# EAGLE design Powermeter (EAGLE 8.5.0)
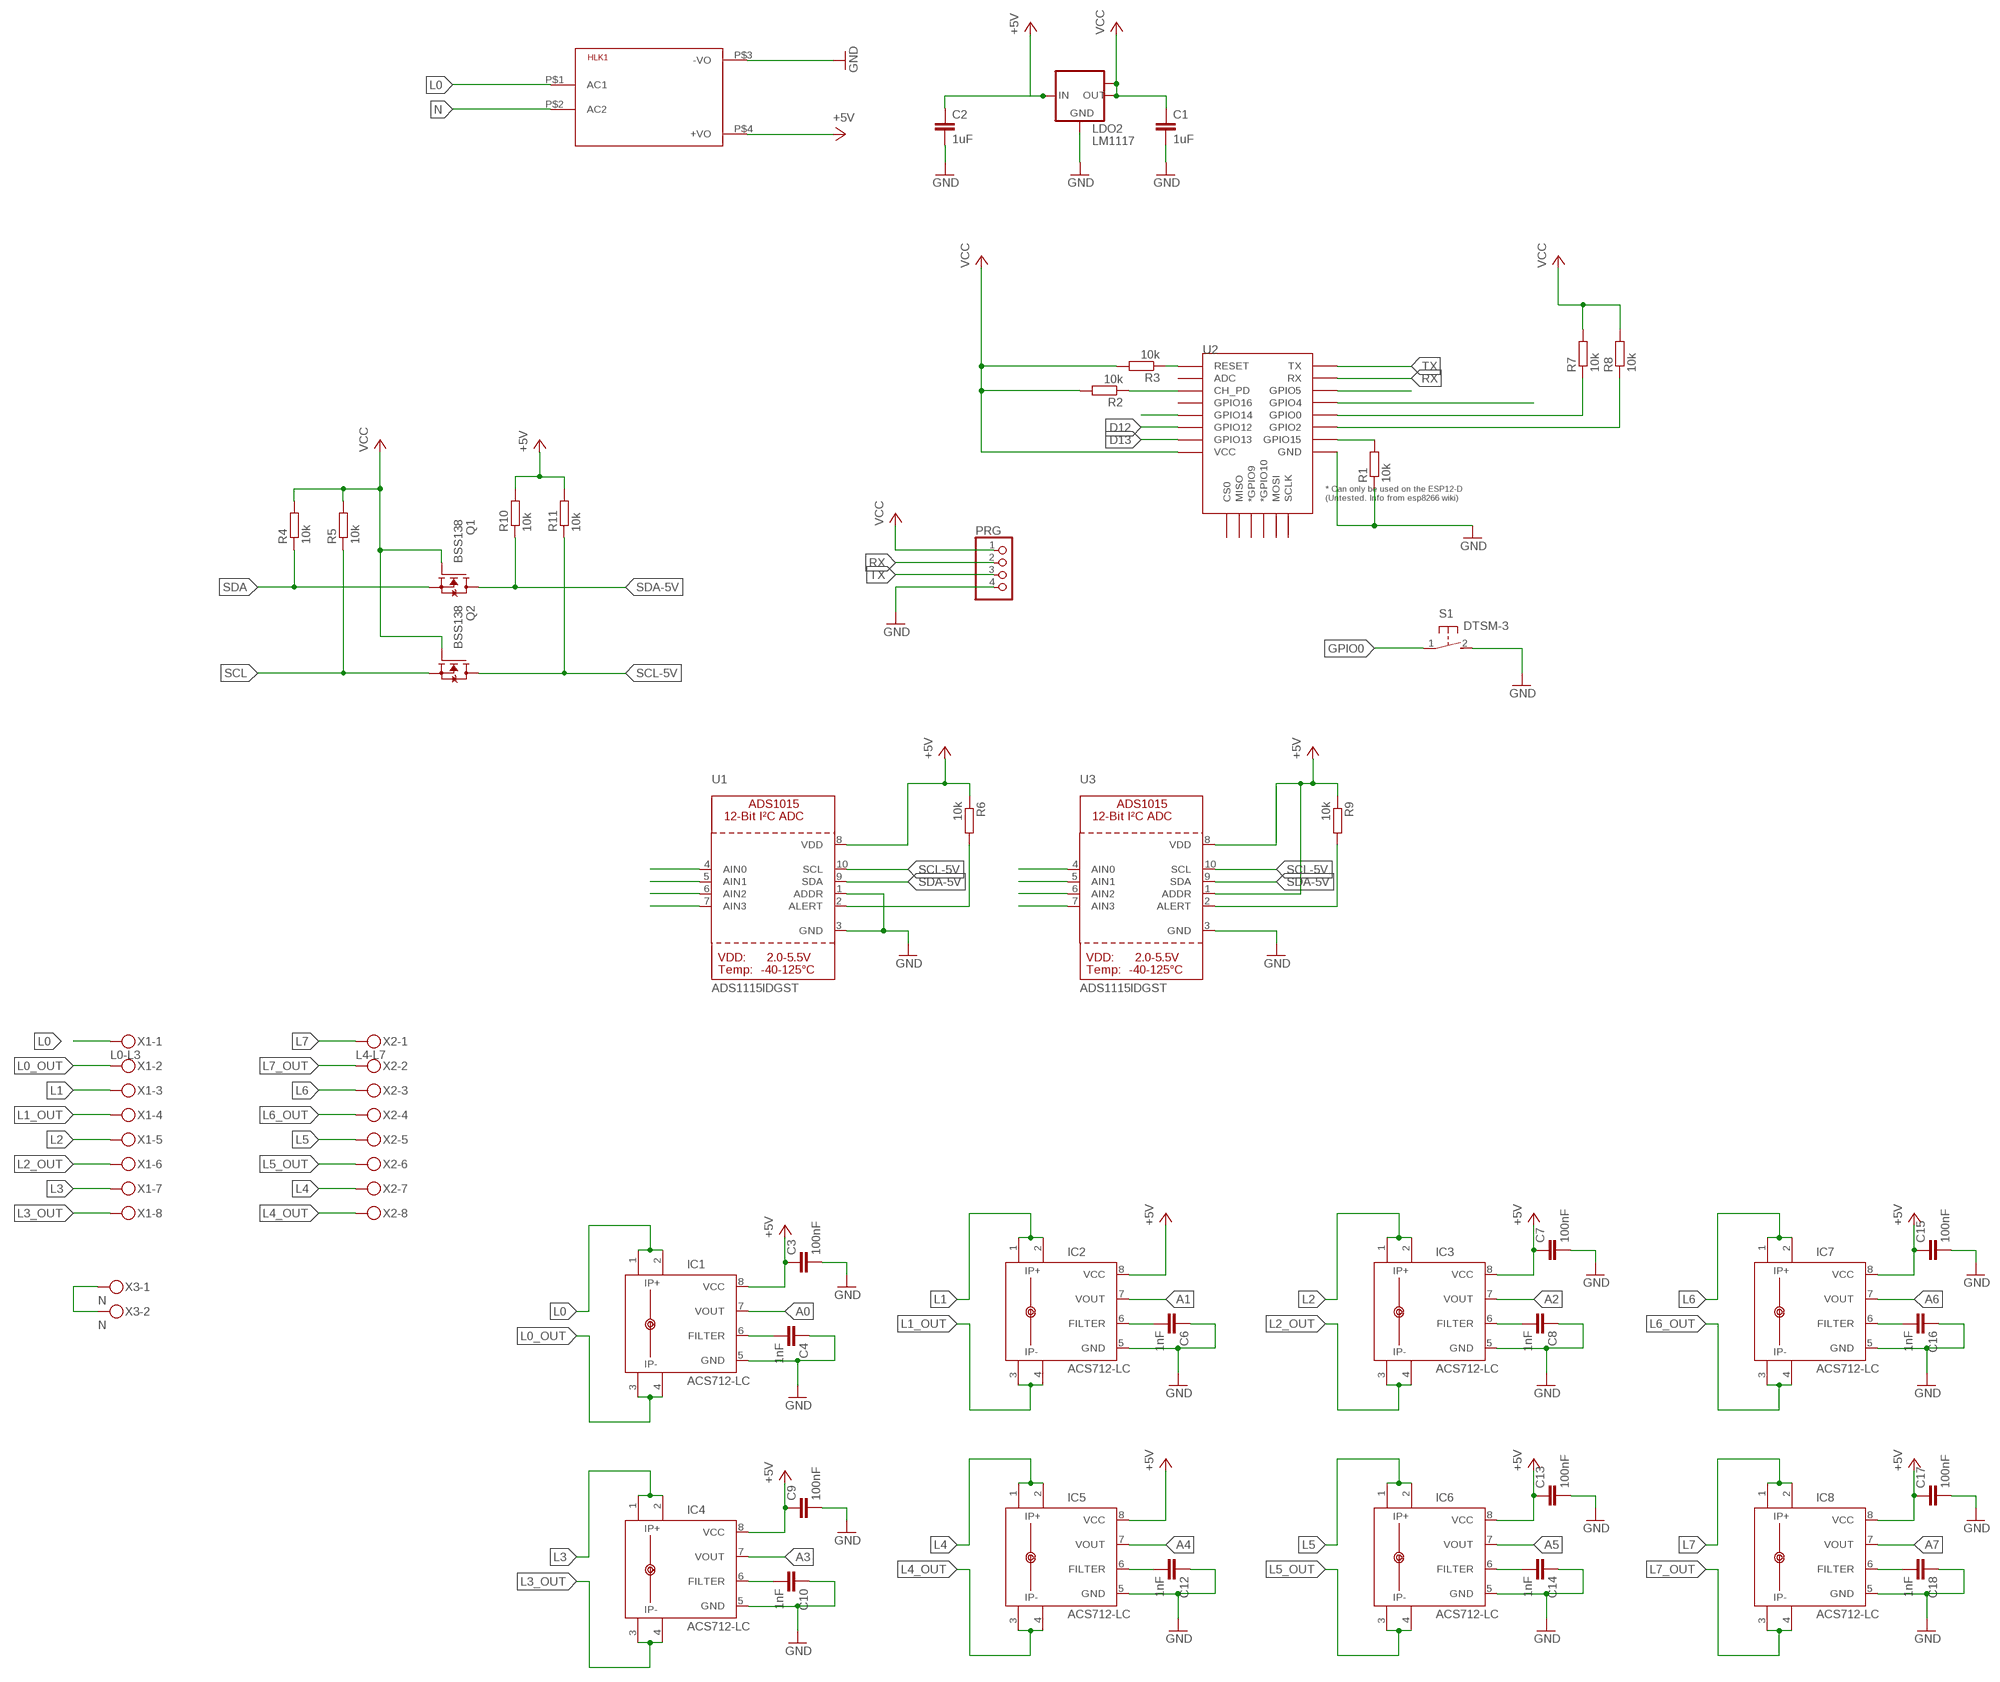
[diagram p0: schematic, sheet 1]

## Parts
C1  1uF  C-EUC0805  [C0805]
C2  1uF  C-EUC0805  [C0805]
C3  100nF  C-EUC0805  [C0805]
C4  1nF  C-EUC0805  [C0805]
C6  1nF  C-EUC0805  [C0805]
C7  100nF  C-EUC0805  [C0805]
C8  1nF  C-EUC0805  [C0805]
C9  100nF  C-EUC0805  [C0805]
C10  1nF  C-EUC0805  [C0805]
C12  1nF  C-EUC0805  [C0805]
C13  100nF  C-EUC0805  [C0805]
C14  1nF  C-EUC0805  [C0805]
C15  100nF  C-EUC0805  [C0805]
C16  1nF  C-EUC0805  [C0805]
C17  100nF  C-EUC0805  [C0805]
C18  1nF  C-EUC0805  [C0805]
HLK1  HLK-PM013W  [HLK-PM01]
IC1  ACS712-LC  [SOIC8]
IC2  ACS712-LC  [SOIC8]
IC3  ACS712-LC  [SOIC8]
IC4  ACS712-LC  [SOIC8]
IC5  ACS712-LC  [SOIC8]
IC6  ACS712-LC  [SOIC8]
IC7  ACS712-LC  [SOIC8]
IC8  ACS712-LC  [SOIC8]
LDO2  LM1117  LM1117MPX-3.3  [SOT223]
PRG  PINHD-1X04_2.54-S  [1X04-S]
Q1  BSS138  [SOT23]
Q2  BSS138  [SOT23]
R1  10k  R-EU_R0805  [R0805]
R2  10k  R-EU_R0805  [R0805]
R3  10k  R-EU_R0805  [R0805]
R4  10k  R-EU_R0805  [R0805]
R5  10k  R-EU_R0805  [R0805]
R6  10k  R-EU_R0805  [R0805]
R7  10k  R-EU_R0805  [R0805]
R8  10k  R-EU_R0805  [R0805]
R9  10k  R-EU_R0805  [R0805]
R10  10k  R-EU_R0805  [R0805]
R11  10k  R-EU_R0805  [R0805]
S1  DTSM-3  [DTSM-3]
U1  ADS1115IDGST  ADC_ADS1015  [MSOP10]
U2  ESP12ESMD  [ESP12E-SMD]
U3  ADS1115IDGST  ADC_ADS1015  [MSOP10]
X1  L0-L3  MKDSN1,5/8-5,08  [MKDSN1,5/8-5,08]
X2  L4-L7  MKDSN1,5/8-5,08  [MKDSN1,5/8-5,08]
X3  N  MKDSN1,5/2-5,08  [MKDSN1,5/2-5,08]

## Nets
+5V: C2.1 C3.1 C7.1 C9.1 C13.1 C15.1 C17.1 HLK1.P$4(+VO) IC1.8(VCC) IC2.8(VCC) IC3.8(VCC) IC4.8(VCC) IC5.8(VCC) IC6.8(VCC) IC7.8(VCC) IC8.8(VCC) LDO2.3(IN) R6.1 R9.1 R10.2 R11.2 U1.8(VDD) U3.1(ADDR) U3.8(VDD)
A0: IC1.7(VOUT) U1.4(AIN0)
A1: IC2.7(VOUT) U1.5(AIN1)
A2: IC3.7(VOUT) U1.6(AIN2)
A3: IC4.7(VOUT) U1.7(AIN3)
A4: IC5.7(VOUT) U3.4(AIN0)
A5: IC6.7(VOUT) U3.5(AIN1)
A6: IC7.7(VOUT) U3.6(AIN2)
A7: IC8.7(VOUT) U3.7(AIN3)
D2: R8.1 U2.GPIO2
D12: U2.GPIO12
D13: U2.GPIO13
D14: U2.GPIO14
GND: C1.2 C2.2 C3.2 C4.1 C6.1 C7.2 C8.1 C9.2 C10.1 C12.1 C13.2 C14.1 C15.2 C16.1 C17.2 C18.1 HLK1.P$3(-VO) IC1.5(GND) IC2.5(GND) IC3.5(GND) IC4.5(GND) IC5.5(GND) IC6.5(GND) IC7.5(GND) IC8.5(GND) LDO2.1(GND) PRG.4 R1.1 S1.2 U1.1(ADDR) U1.3(GND) U2.GND U3.3(GND)
GPIO0: R7.1 S1.1 U2.GPIO0
L0 [power]: HLK1.P$1(AC1) IC1.1(IP+) IC1.2(IP+1) X1.1
L0_OUT: IC1.3(IP-) IC1.4(IP-1) X1.2
L1: IC2.1(IP+) IC2.2(IP+1) X1.3
L1_OUT: IC2.3(IP-) IC2.4(IP-1) X1.4
L2: IC3.1(IP+) IC3.2(IP+1) X1.5
L2_OUT: IC3.3(IP-) IC3.4(IP-1) X1.6
L3: IC4.1(IP+) IC4.2(IP+1) X1.7
L3_OUT: IC4.3(IP-) IC4.4(IP-1) X1.8
L4: IC5.1(IP+) IC5.2(IP+1) X2.7
L4_OUT: IC5.3(IP-) IC5.4(IP-1) X2.8
L5: IC6.1(IP+) IC6.2(IP+1) X2.5
L5_OUT: IC6.3(IP-) IC6.4(IP-1) X2.6
L6: IC7.1(IP+) IC7.2(IP+1) X2.3
L6_OUT: IC7.3(IP-) IC7.4(IP-1) X2.4
L7: IC8.1(IP+) IC8.2(IP+1) X2.1
L7_OUT: IC8.3(IP-) IC8.4(IP-1) X2.2
N [power]: HLK1.P$2(AC2) X3.1 X3.2
N$1: R1.2 U2.GPIO15
N$2: R6.2 U1.2(ALERT)
N$3: R2.1 U2.CH_PD
N$4: R9.2 U3.2(ALERT)
N$5: C4.2 IC1.6(FILTER)
N$6: C6.2 IC2.6(FILTER)
N$7: C8.2 IC3.6(FILTER)
N$8: C10.2 IC4.6(FILTER)
N$9: C12.2 IC5.6(FILTER)
N$10: C14.2 IC6.6(FILTER)
N$11: C16.2 IC7.6(FILTER)
N$12: C18.2 IC8.6(FILTER)
RESET: R3.1 U2.RESET
RX: PRG.2 U2.RXD0(RX)
SCL: Q2.2(S) R5.1 U2.GPIO5
SCL-5V: Q2.3(D) R11.1 U1.10(SCL) U3.10(SCL)
SDA: Q1.2(S) R4.1 U2.GPIO4
SDA-5V: Q1.3(D) R10.1 U1.9(SDA) U3.9(SDA)
TX: PRG.3 U2.TXD0(TX)
VCC: C1.1 LDO2.2(OUT) LDO2.TAB(OUT1) PRG.1 Q1.1(G) Q2.1(G) R2.2 R3.2 R4.2 R5.2 R7.2 R8.2 U2.VCC
Unconnected: U2.ADC U2.CS0 U2.GPIO9(*GPIO9) U2.GPIO10(*GPIO10) U2.GPIO16 U2.MISO U2.MOSI U2.SCLK

## Library data of the parts
C1-C4 C6-C10 C12-C18 = rcl:C-EU: CAPACITOR, European symbol; SPICEPREFIX: C
HLK1 = HLK-PM01:HLK-PM01: Hi-Link Power Supply HLK-PM01 3W Author: Ahmed Said <https://github.com/AhmedSaid/EAGLELibraries>
IC1-IC8 = allegro-2:ACS712-LC
LDO2 = lm1117:LM1117MPX-*
PRG = pinhead-2:PINHD-1X04: PIN HEADER
Q1 Q2 = bss138_10:BSS138: BSS138 N-Channel Logic Level Enhancement Mode Field Effect Transistor Source: http://www.fairchildsemi.com/datasheets/BS/BSS138.pdf; MF: Fairchild; MPN: BSS138; OC_FARNELL: 9845330; OC_NEWARK: 67R2009
R1-R11 = rcl:R-EU_: RESISTOR, European symbol; SPICEPREFIX: R
S1 = switch-tact:DTSM-3
U1 U3 = microbuilder:ADC_ADS1015: ADS1015 - 12-bit 4-Channel I2C ADC with Internal PGA VDD: 2.0-5.5V Sampling Rate: 3.3ksps Gain Settings: 2/3, 1, 2, 4, 8, 16 I2C Address: ADDR low = 1001000x, ADDR high = 1001001x Internal Comparator The ADS1015 includes an internal comparator that can be set to output a high-level on ALERT when the conversion results exceeeds a pre-defined upper level, and will deassert itself when the level falls below a pre-defined lower threshold level. It can also be set to windowed mode where the ALERT pin will be asserted if the data exceeds the upper threshold or falls below the lower threshold.
U2 = esp8266modules:ESP12E: ESP12E Module
X1 X2 = con-phoenix-508:MKDSN1,5/8-5,08: MKDSN 1,5/ 8-5,08 Printklemme Nennstrom: 13,5 A Nennspannung: 250 V Rastermaß: 5,08 mm Polzahl: 8 Anschlussart: Schraubanschluss Montage: Löten Anschlussrichtung Leiter/Platine: 0 ° Artikelnummer: 1729186 Source: http://eshop.phoenixcontact.com .. 1729186.pdf
X3 = con-phoenix-508:MKDSN1,5/2-5,08: MKDSN 1,5/ 2-5,08 Printklemme Nennstrom: 13,5 A Nennspannung: 250 V Rastermaß: 5,08 mm Polzahl: 2 Anschlussart: Schraubanschluss Montage: Löten Anschlussrichtung Leiter/Platine: 0 ° Artikelnummer: 1729128 Source: http://eshop.phoenixcontact.com .. 1729128.pdf

## Net classes
0 default: width 0.152 mm
1 power: width 0.381 mm

## Board
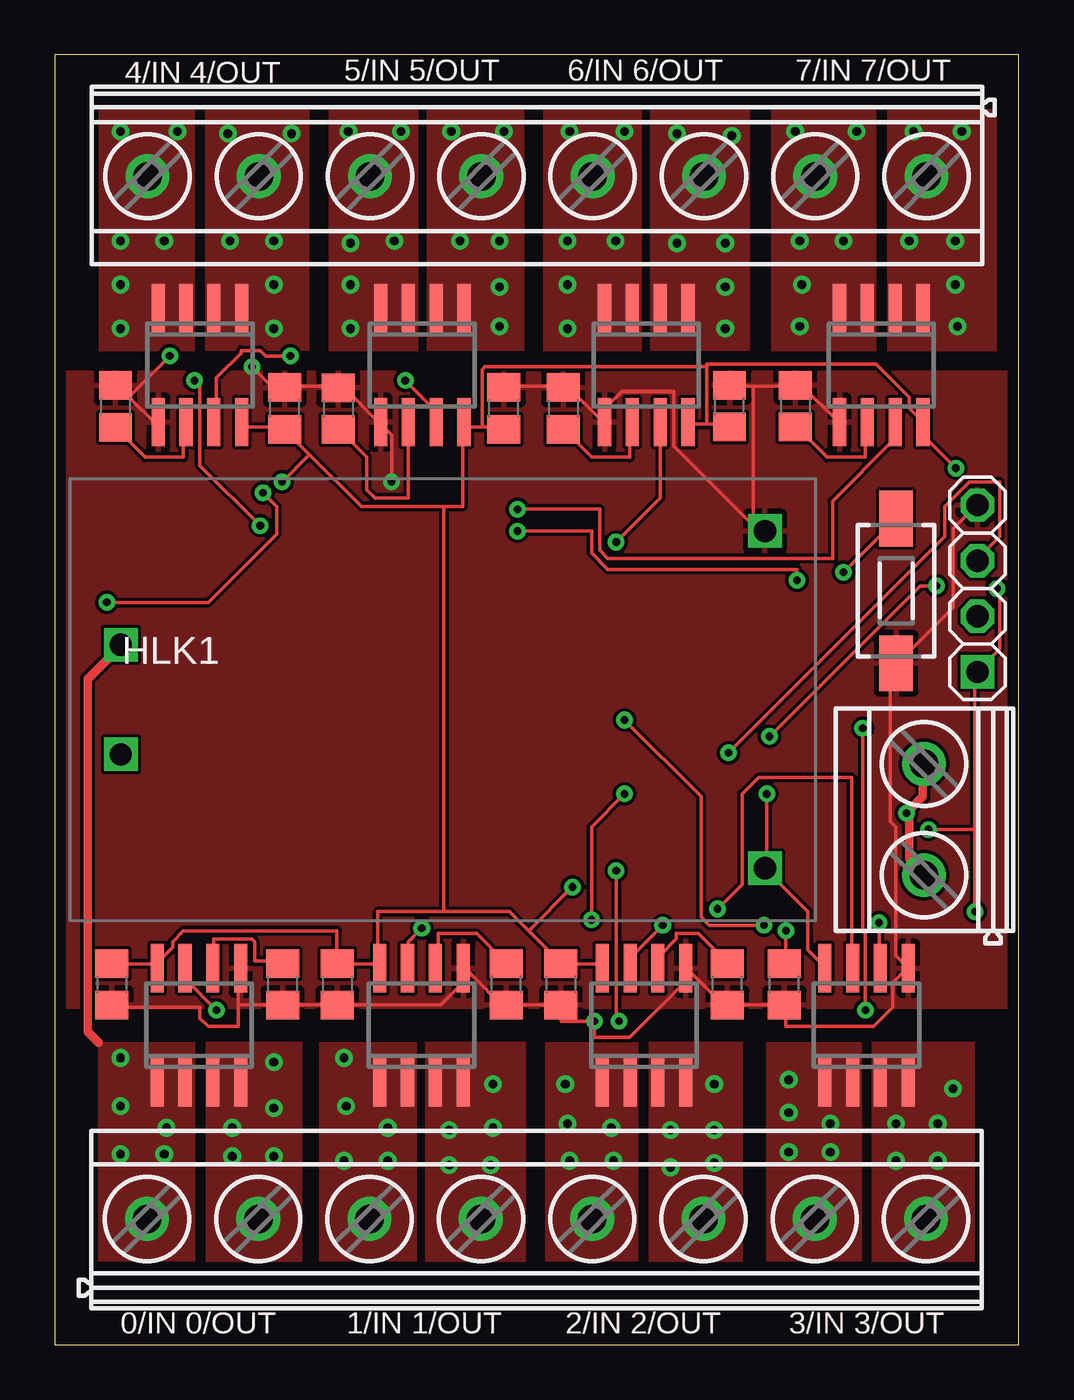
[diagram p1: board, top side]
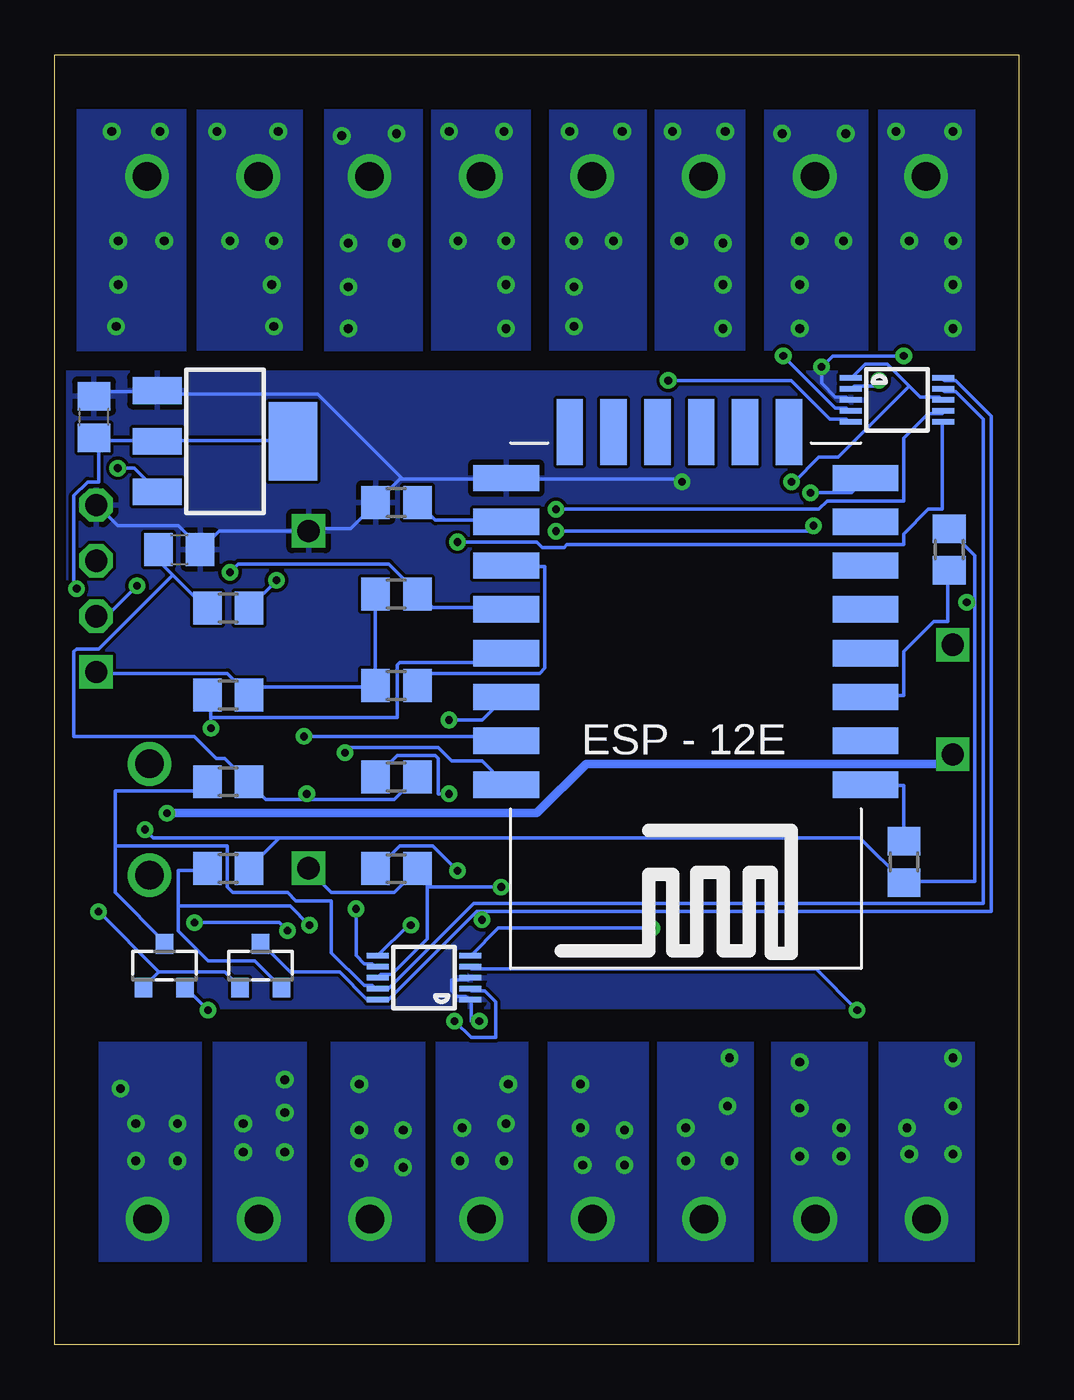
[diagram p2: board, bottom side, seen from below]

Size 44 x 58.9 mm. Coordinates in mm from the lower left corner, seen from the top.
Outline: 0,0 44,0 44,58.9 0,58.9 0,0
Copper layers (1*16): Top 0.035mm / dielectric 1.5mm / Bottom 0.035mm
Design rules "default *": minimum track width 6mil, minimum drill 0.35mm, track to track 6mil, track to pad 6mil, pad to pad 6mil, via to via 6mil, smd to smd 6mil, copper to edge 20mil, drill to drill 6mil, minimum pad ring 10mil, minimum via ring 8mil, stop-mask expansion 4mil, vias tented up to drill 100mil, thermal gap 10mil

### Footprints (pad centres in the part's own frame; a part is rotated, then mirrored left to right if it is on the bottom)
C0805 = smd 1.3 x 1.5: 1 -0.95,0; 2 0.95,0
HLK-PM01 = drill 1.016 square: P$1 -14.7,2.5; P$2 -14.7,-2.5; P$3 14.7,7.7; P$4 14.7,-7.7
SOIC8 = smd 0.6 x 2.2: 1 -1.905,-2.6; 2 -0.635,-2.6; 3 0.635,-2.6; 4 1.905,-2.6; 5 1.905,2.6; 6 0.635,2.6; 7 -0.635,2.6; 8 -1.905,2.6
SOT223 = smd 1.219 x 2.235: 1 -2.311,-3.099; 2 0,-3.099; 3 2.311,-3.099 | smd 3.6 x 2.2: TAB 0,3.099
1X04-S = drill 1.016 square: 1 -3.81,0 | drill 1.016 octagon: 2 -1.27,0; 3 1.27,0; 4 3.81,0
SOT23 = smd 0.8 x 0.9: 1 -0.95,-1; 2 0.95,-1; 3 0,1
R0805 = smd 1.3 x 1.5: 1 -0.95,0; 2 0.95,0
DTSM-3 = smd 2.54 x 1.524: 1 -3.302,0; 2 3.302,0
MSOP10 = smd 0.25 x 1: 1 -1,-2.113; 2 -0.5,-2.113; 3 0,-2.113; 4 0.5,-2.113; 5 1,-2.113; 6 1,2.113; 7 0.5,2.113; 8 0,2.113; 9 -0.5,2.113; 10 -1,2.113
ESP12E-SMD = smd 3 x 1.2: ADC -8.3,3.8; CH_PD -8.3,1.8; GND 8.1,-8.2; GPIO0 8.1,-2.2; GPIO2 8.1,-4.2; GPIO4 8.1,-0.2; GPIO5 8.1,1.8; GPIO12 -8.3,-4.2; GPIO13 -8.3,-6.2; GPIO14 -8.3,-2.2; GPIO15 8.1,-6.2; GPIO16 -8.3,-0.2; RESET -8.3,5.8; RXD0 8.1,3.8; TXD0 8.1,5.8; VCC -8.3,-8.2 | smd 1.2 x 3: CS0 -4.8,-10.3; GPIO9 -0.8,-10.3; GPIO10 1.2,-10.3; MISO -2.8,-10.3; MOSI 3.2,-10.3; SCLK 5.2,-10.3
MKDSN1,5/8-5,08 = drill 1.3 pad 2: 1 -17.801,0.025; 2 -12.721,0.025; 3 -7.641,0.025; 4 -2.561,0.025; 5 2.519,0.025; 6 7.599,0.025; 7 12.679,0.025; 8 17.759,0.025
MKDSN1,5/2-5,08 = drill 1.3 pad 2: 1 -2.561,0.025; 2 2.519,0.025

### Placement (x,y rotation side)
C1  42.21,42.36 90 bottom
C2  38.32,36.31 0 bottom
C3  2.6,16.46 270 top
C4  10.4,16.46 90 top
C6  20.6,16.46 90 top
C7  23.1,16.46 270 top
C8  30.7,16.46 90 top
C9  12.9,16.46 270 top
C10  33.3,16.46 90 top
C12  2.77,42.85 270 top
C13  30.8,42.86 90 top
C14  12.93,42.74 270 top
C15  10.5,42.76 90 top
C16  23.2,42.76 270 top
C17  20.5,42.76 90 top
C18  33.8,42.86 270 top
HLK1  17.71,29.46 0 top
IC1  6.58,14.59 0 top
IC2  16.74,14.59 0 top
IC3  26.89,14.59 0 top
IC4  37.05,14.59 0 top
IC5  6.62,44.73 180 top
IC6  16.78,44.73 180 top
IC7  27,44.73 180 top
IC8  37.72,44.73 180 top
LDO2  36.23,41.25 270 bottom
PRG  42.11,34.53 90 top
Q1  39,17.3 0 bottom
Q2  34.6,17.3 0 bottom
R1  28.41,38.46 0 bottom
R2  3.18,36.3 90 bottom
R3  5.24,22.04 270 bottom
R4  36.09,29.67 0 bottom
R5  36.09,21.75 0 bottom
R6  28.41,21.74 180 bottom
R7  28.41,34.28 180 bottom
R8  28.41,30.1 180 bottom
R9  36.09,33.63 0 bottom
R10  36.09,25.71 0 bottom
R11  28.41,25.92 0 bottom
S1  38.4,34.42 270 top
U1  27.14,16.76 90 bottom
U2  15.29,31.38 180 bottom
U3  5.56,43.14 270 bottom
X1  22.01,5.72 0 top
X2  21.99,53.38 180 top
X3  39.7,24 90 top

### Tracks (layer width: path | path; a pad name or v marks a point on that pad's centre or on a via)
+5V  (via drill 0.35)
  Top 0.152: IC4.8 35.12,17.27 34.38,18.02 34.38,19.77 32.5,21.65 HLK1.P$4 32.5,21.77 v32.5,25.15 | 4.62,17.4 2.62,17.4 C3.1 | 4.62,17.4 4.62,17.27 IC1.8 4.62,17.4 | IC3.8 24.88,17.27 24.88,17.4 23.12,17.4 C7.1 23,17.52 21.62,18.9 | 14.75,17.4 13,17.4 C9.1 12.88,17.52 12.88,18.9 5.88,18.9 5.38,18.4 5.38,18.15 4.62,17.4 | 14.75,17.4 14.75,17.27 IC2.8 14.75,17.4 | 21.62,18.9 20.75,19.77 17.75,19.77 | 17.75,19.77 14.75,19.77 14.75,17.4 | IC5.8 8.62,42.02 8.62,41.9 10.38,41.9 C15.1 10.5,41.77 11.62,40.65 | 19.5,41.9 18.75,41.9 18.75,42.02 IC6.8 18.62,42.02 18.62,38.27 17.75,38.27 | 19.5,41.9 20.38,41.9 C17.1 | 29.75,42.02 29,42.02 IC7.8 | 29.75,42.02 30.75,42.02 C13.1 | 29.75,42.02 29.75,44.65 | 29.75,44.65 29.75,44.77 37.5,44.77 39,43.27 39,42.77 39.62,42.15 IC8.8 39.75,42.02 39.75,41.4 v41.12,40.02 | 19.5,41.9 19.5,44.52 19.62,44.65 29.75,44.65 | 11.62,40.65 14,38.27 17.75,38.27 | 11.62,40.65 v10.38,39.4 | 17.75,38.27 17.75,19.77 | 21.62,18.9 v23.62,20.9
  Bottom 0.152: 27,20.9 27,21.65 27.38,21.65 R6.1 27.5,21.65 28.5,20.65 31.38,20.65 32.38,21.65 HLK1.P$4 | 27,20.9 27,18.52 28.62,16.9 29.12,16.9 29.25,16.77 U1.8 | 38.62,35.15 39.25,35.77 39.25,36.27 C2.1 | 38.62,35.15 37.12,33.65 R9.1 | 32.5,24.9 34.38,24.9 35.12,25.65 R10.2 35.25,25.77 36.25,26.77 36.62,26.77 37.62,27.77 43.12,27.77 43.12,31.65 43,31.77 42,31.77 38.62,35.15 | 32.5,24.9 28.5,24.9 27.5,25.9 R11.2 | 32.5,24.9 v32.5,25.15 | 5,43.77 6,44.77 7,44.77 7.62,44.15 U3.1 | 5,43.77 4.5,43.27 3.62,43.27 3.5,43.15 U3.8 | v41.12,40.02 40.38,40.02 39.38,39.02 LDO2.3 | 5,43.77 8.25,40.52 9.12,40.52 10.25,39.4 v10.38,39.4 | v23.62,20.9 27,20.9
A0  (via drill 0.35)
  Top 0.152: v7.38,15.28 6,16.65 6,17.15 IC1.7
  Bottom 0.152: v7.38,15.28 9.25,17.15 25,17.15 U1.4
A1  (via drill 0.35)
  Top 0.152: v16.75,19.02 16.12,18.4 16.12,17.27 IC2.7
  Bottom 0.152: v16.75,19.02 23.75,19.02 25,17.77 U1.5
A2  (via drill 0.35)
  Top 0.152: v27.75,19.15 26.38,17.77 26.38,17.27 IC3.7
  Bottom 0.152: v27.75,19.15 27.88,19.15 29.25,17.77 U1.6
A3  (via drill 0.35)
  Top 0.152: v30.25,19.9 31.38,21.02 31.38,25.15 32.12,25.9 36.38,25.9 36.38,17.27 IC4.7
  Bottom 0.152: v30.25,19.9 30.25,17.77 29.88,17.4 29.5,17.4 29.38,17.27 U1.7
A4  (via drill 0.35)
  Top 0.152: v10.75,45.15 9.62,45.15 9.38,45.4 8.5,45.4 8.5,45.27 7.38,44.15 7.38,42.15 IC5.7
  Bottom 0.152: v10.75,45.15 8.38,42.77 7.88,42.77 7.75,42.65 U3.4
A5  (via drill 0.35)
  Top 0.152: v16,44.02 17.38,42.65 17.38,42.15 IC6.7
  Bottom 0.152: v16,44.02 10.38,44.02 8.62,42.27 7.88,42.27 7.75,42.15 U3.5
A6  (via drill 0.35)
  Top 0.152: v25.62,36.65 27.62,38.65 27.62,42.02 IC7.7
  Bottom 0.152: v25.62,36.65 22,36.65 21.75,36.4 20.75,36.4 20.62,36.52 5.25,36.52 5.25,37.02 4.12,38.15 3.5,38.15 3.5,42.02 U3.6
A7  (via drill 0.35)
  Top 0.152: v21.12,38.15 24.88,38.15 24.88,36.27 25.25,35.9 35.5,35.9 35.5,38.52 38.25,41.27 38.25,42.02 IC8.7
  Bottom 0.152: v21.12,38.15 9.12,38.15 8.75,38.52 5.25,38.52 5.25,41.4 4.12,42.52 3.5,42.52 U3.7
D2
  Bottom 0.152: R8.1 27.38,30.15 26.88,30.65 21.88,30.65 21.62,30.9 21.62,35.52 23.38,35.52 U2.GPIO2
GND  (via drill 0.35)
  Top 0.152: 29.12,16.9 30.62,15.4 C8.1 30.75,15.53 33.25,15.53 C10.1 33.38,15.4 33.38,14.53 37.38,14.53 38.25,15.4 38.25,16.52 38.88,17.15 IC4.5 38.88,17.27 38.38,17.77 38.38,23.65 38.12,23.9 38.12,30.77 38.38,31.02 S1.2 38.5,31.15 41,33.65 41,37.27 42,38.27 PRG.4 | 29.12,16.9 28.88,17.15 IC3.5 | 19,16.9 20.5,15.4 C6.1 20.62,15.53 23,15.53 C7.2 23.12,15.4 23.12,14.78 v24.62,14.78 24.62,14.03 26.25,14.03 29.12,16.9 | 19,16.9 18.75,17.15 IC2.5 | 8.38,15.53 8.38,17.15 IC1.5 | 8.38,15.53 8.38,14.53 7,14.53 6.62,14.9 6.62,15.4 2.62,15.4 C3.2 | 8.38,15.53 10.38,15.53 C4.1 10.5,15.53 12.88,15.53 C9.2 13,15.53 17.62,15.53 19,16.9 | 3.38,43.27 4.62,42.02 IC5.5 | 3.38,43.27 2.88,43.77 C12.1 3.38,43.27 | v9,44.65 10.12,43.52 10.38,43.52 10.38,43.65 C15.2 10.5,43.77 12.88,43.77 C14.1 13,43.65 13.25,43.65 14.75,42.15 IC6.5 14.88,42.02 15.38,41.52 v15.38,39.4 | v5.25,45.15 3.38,43.27 | 31.88,43.77 33.75,43.77 C18.1 33.88,43.77 34.12,43.77 35.75,42.15 IC8.5 | 31.88,43.77 30.88,43.77 C13.2 | C17.2 20.5,43.77 23.12,43.77 C16.1 23.25,43.65 23.5,43.65 24.75,42.4 | 24.75,42.4 25,42.15 IC7.5 | 24.75,42.4 25.88,43.52 28.25,43.52 28.25,41.02 31.88,37.4 | 31.88,37.4 32,37.27 32.38,37.27 HLK1.P$3 31.88,37.4 | 31.88,37.4 31.88,43.77
  Bottom 0.152: U1.3 25.12,16.65 25.88,16.65 25.88,16.15 25.62,15.9 25.25,15.9 25.12,15.78 U1.1 25,15.65 25,14.78 v24.62,14.78 | U3.3 7.75,43.15 7.88,43.27 8.38,43.27 9,43.9 v9,44.65 8.5,45.15 v5.25,45.15 | C1.2 42.12,43.4 42,43.52 39.38,43.52 LDO2.1 39.25,43.52 39.12,43.4 32,43.4 28.12,39.52 | 28.12,39.52 28.25,39.52 29.25,38.52 R1.1 29.38,38.4 30.5,37.27 32.38,37.27 HLK1.P$3 32.5,37.15 36.5,37.15 37.25,36.4 C2.2 37.38,36.4 38.38,37.4 41.12,37.4 42,38.27 PRG.4 | 28.12,39.52 23.5,39.52 U2.GND 23.38,39.52 15.5,39.52 v15.38,39.4
  pour Bottom: 0,44.4 0,15.4 44,15.4 44,44.4
  pour Top: 0,44.4 0,15.4 44,15.4 44,44.4
GPIO0  (via drill 0.35)
  Top 0.152: v36,35.27 38.38,37.65 S1.1
  Bottom 0.152: U2.GPIO0 23.5,33.65 26.75,33.65 27.38,34.27 R7.1 27.5,34.4 28.75,35.65 35.62,35.65 v36,35.27
L0  (via drill 0.4)
  Top 0.381: HLK1.P$1 3,31.9 1.5,30.4 1.5,14.28 2,13.78 2,13.8
  other vias: 3,13.1 3,10.9 5.1,9.9 5,8.7 3,8.7
  pour Top (no thermals): 2,3.8 2,13.8 6.4,13.8 6.4,3.8
  pour Bottom (no thermals): 2,3.8 2,13.8 6.4,13.8 6.4,3.8
L0_OUT  (via drill 0.4)
  other vias: 8.1,8.6 10,8.6 10,10.8 8.1,9.9 10,12.9
  pour Top (no thermals): 6.9,13.8 6.9,3.8 11.3,3.8 11.3,13.8
  pour Bottom (no thermals): 6.9,3.8 6.9,13.8 11.3,13.8 11.3,3.8
L1  (via drill 0.4)
  other vias: 13.3,10.9 13.2,13.1 13.2,8.4 15.2,8.4 15.2,9.9
  pour Top (no thermals): 12.1,3.8 12.1,13.8 16.5,13.8 16.5,3.8
  pour Bottom (no thermals): 12.1,3.8 12.1,13.8 16.5,13.8 16.5,3.8
L1_OUT  (via drill 0.4)
  other vias: 18,8.2 18,9.8 20,9.9 19.9,8.2 20,11.9
  pour Top (no thermals): 16.9,13.8 16.9,3.8 21.5,3.8 21.5,13.8
  pour Bottom (no thermals): 16.9,3.8 16.9,13.8 21.5,13.8 21.5,3.8
L2  (via drill 0.4)
  other vias: 23.3,11.9 23.4,10.1 25.4,9.9 25.5,8.4 23.5,8.4
  pour Top (no thermals): 22.4,3.8 22.4,13.8 26.6,13.8 26.6,3.8
  pour Bottom (no thermals): 22.4,3.8 22.4,13.8 26.6,13.8 26.6,3.8
L2_OUT  (via drill 0.4)
  other vias: 28.1,9.8 28.1,8.1 30.1,8.3 30.1,9.8 30.1,11.9
  pour Top (no thermals): 31.4,3.8 31.4,13.8 27.1,13.8 27.1,3.8
  pour Bottom (no thermals): 27.1,3.8 27.1,13.8 31.4,13.8 31.4,3.8
L3  (via drill 0.4)
  other vias: 33.5,12.1 33.5,10.6 33.5,8.8 35.4,10.1 35.4,8.8
  pour Top (no thermals): 32.5,3.8 32.5,13.8 36.8,13.8 36.8,3.8
  pour Bottom (no thermals): 32.5,3.8 32.5,13.8 36.8,13.8 36.8,3.8
L3_OUT  (via drill 0.4)
  other vias: 38.4,10.1 38.4,8.4 40.3,8.4 40.3,10.1 41,11.7
  pour Top (no thermals): 42,3.8 42,13.8 37.3,13.8 37.3,3.8
  pour Bottom (no thermals): 37.3,3.8 37.3,13.8 42,13.8 42,3.8
L4  (via drill 0.4)
  other vias: 10,46.4 10,48.4 10,50.4 8,50.4 7.9,55.3 10.8,55.3
  pour Top (no thermals): 6.9,45.4 6.9,56.4 11.6,56.4 11.6,45.4
  pour Bottom (no thermals): 6.9,45.4 11.6,45.4 11.6,56.4 6.9,56.4
L4_OUT  (via drill 0.4)
  other vias: 3,50.4 5,50.4 3,48.4 3,46.4 3,55.4 5.6,55.4
  pour Top (no thermals): 6.4,45.4 6.4,56.4 2,56.4 2,45.4
  pour Bottom (no thermals): 2,45.4 6.4,45.4 6.4,56.4 2,56.4
L5  (via drill 0.4)
  other vias: 18.5,50.4 20.3,50.4 20.3,48.3 20.3,46.5 18.1,55.4 20.5,55.4
  pour Top (no thermals): 17,45.4 17,56.4 21.4,56.4 21.4,45.4
  pour Bottom (no thermals): 17,45.4 21.4,45.4 21.4,56.4 17,56.4
L5_OUT  (via drill 0.4)
  other vias: 13.4,55.4 15.8,55.4 13.5,50.3 15.5,50.4 13.5,48.4 13.5,46.4
  pour Top (no thermals): 12.5,56.4 12.5,45.4 16.6,45.4 16.6,50.1 16.6,56.4
  pour Bottom (no thermals): 16.6,45.4 16.6,56.4 12.5,56.4 12.5,45.4
L6  (via drill 0.4)
  other vias: 28.4,55.3 30.9,55.2 28.4,50.3 30.6,50.3 30.6,48.3 30.6,46.4
  pour Top (no thermals): 27.2,45.4 27.2,56.4 31.7,56.4 31.7,45.4
  pour Bottom (no thermals): 27.2,45.4 27.2,56.4 31.7,56.4 31.7,45.4
L6_OUT  (via drill 0.4)
  other vias: 23.4,50.4 23.4,48.4 23.4,46.4 25.6,50.4 23.5,55.4 26,55.4
  pour Top (no thermals): 26.8,45.4 26.8,56.4 22.3,56.4 22.3,45.4
  pour Bottom (no thermals): 22.6,45.4 26.8,45.4 26.8,49.7 26.8,56.4 22.3,56.4 22.3,45.4
L7  (via drill 0.4)
  other vias: 39.2,55.4 39,50.4 41.1,50.4 41.1,48.4 41.2,46.5 41.4,55.4
  pour Top (no thermals): 38,45.4 43,45.4 43,56.4 38,56.4
  pour Bottom (no thermals): 38,45.4 38,56.4 43,56.4 43,45.4
L7_OUT  (via drill 0.4)
  other vias: 34,46.5 34.1,48.4 34,50.4 36,50.4 36.6,55.4 33.8,55.4
  pour Top (no thermals): 37.5,45.4 37.5,56.4 32.7,56.4 32.7,45.4
  pour Bottom (no thermals): 37.5,45.4 37.5,56.4 32.7,56.4 32.7,45.4
N  (via drill 0.35)
  Top 0.381: X3.2 39.62,26.4 39.62,25.02 v38.88,24.27 39,24.15 39,22.15 39.62,21.52 X3.1
  Bottom 0.381: v38.88,24.27 22,24.27 19.75,26.52 3.5,26.52 3.12,26.9 HLK1.P$2
N$1
  Bottom 0.152: R1.2 27.38,38.4 26.62,37.65 23.5,37.65 U2.GPIO15
N$2  (via drill 0.35)
  Top 0.152: v25.75,14.78 25.62,14.9 v25.62,21.65
  Bottom 0.152: v25.75,14.78 25,14.03 23.88,14.03 23.88,15.65 24.38,16.15 25,16.15 U1.2 | v25.62,21.65 26.75,22.77 28.25,22.77 29.25,21.77 R6.2
N$3
  Bottom 0.152: R2.1 3.25,35.27 3.25,33.02 3.88,33.02 5.25,31.65 5.25,29.65 6.88,29.65 U2.CH_PD
N$4  (via drill 0.35)
  Top 0.152: v6.38,44.02 6.62,43.77 6.62,40.15 v9.38,37.4 | v21.12,37.15 24.5,37.15 24.5,36.15 25.25,35.4 33.88,35.4 v33.88,34.9
  Bottom 0.152: v6.38,44.02 6.62,43.77 7.5,43.77 7.62,43.65 U3.2 | v9.38,37.4 9.62,37.15 v21.12,37.15 | v33.88,34.9 35.12,33.65 R9.2
N$5
  Top 0.152: C4.2 10.38,17.52 9.12,17.52 9.12,18.4 9,18.52 7.25,18.52 7.25,17.27 IC1.6
N$6
  Top 0.152: C6.2 20.5,17.52 19.25,18.77 17.5,18.77 17.5,17.4 17.38,17.27 IC2.6
N$7
  Top 0.152: C8.2 30.62,17.52 29.38,18.77 28.38,18.77 28.38,18.52 27.62,17.77 27.62,17.27 IC3.6
N$8  (via drill 0.35)
  Top 0.152: v33.38,18.9 33.38,17.52 C10.2 | v37.62,19.27 37.62,17.27 IC4.6
  Bottom 0.152: v33.38,18.9 33.75,19.27 v37.62,19.27
N$9
  Top 0.152: C12.2 2.88,41.77 4.12,40.52 5.88,40.52 5.88,42.02 IC5.6
N$10
  Top 0.152: C14.2 13,41.77 14.25,40.52 14.25,39.02 14.62,38.65 16.12,38.65 16.12,42.02 IC6.6
N$11
  Top 0.152: C16.2 23.25,41.77 24.5,40.52 26.25,40.52 26.25,42.02 IC7.6
N$12
  Top 0.152: C18.2 33.88,41.9 35.25,40.52 37,40.52 37,42.02 IC8.6
RESET
  Bottom 0.152: R3.1 5.25,23.02 5.25,25.52 6.88,25.52 U2.RESET
RX  (via drill 0.35)
  Top 0.152: v32.62,27.77 39.5,34.65 v40.25,34.65
  Bottom 0.152: v32.62,27.77 23.62,27.77 23.5,27.65 U2.RXD0 | v40.25,34.65 41.62,33.27 42,33.27 PRG.2
SCL  (via drill 0.35)
  Top 0.152: v26,28.52 29.5,25.02 29.5,19.52 29.88,19.15 v32.38,19.15
  Bottom 0.152: Q2.2 34.88,17.52 37,17.52 38.38,18.9 38.38,20.02 | 38.38,20.02 38.38,21.65 37.12,21.65 R5.1 | v26,28.52 24.5,28.52 23.5,29.52 U2.GPIO5 | v32.38,19.15 33.25,20.02 38.38,20.02
SCL-5V  (via drill 0.35)
  Top 0.152: v26,25.15 24.5,23.65 v24.5,19.4
  Bottom 0.152: Q2.3 34.5,18.27 33.25,17.02 31,17.02 29.75,15.78 29.38,15.78 U1.10 29.25,15.78 28.75,15.78 24.75,19.77 24.5,19.77 | 24.5,19.77 1.25,19.77 1.25,42.4 2.88,44.02 3.38,44.02 U3.10 | v26,25.15 26.5,25.15 26.5,26.77 26.62,26.9 28.38,26.9 29.25,26.02 R11.1 | 24.5,19.77 v24.5,19.4
SDA  (via drill 0.35)
  Top 0.152: v37,15.28 37,18.77 36.88,18.9 v36.88,28.15
  Bottom 0.152: v37,15.28 38,16.27 Q1.2 | 36.88,28.65 36.88,29.65 37,29.65 R4.1 | 36.88,28.65 v36.88,28.15 | 36.88,28.65 28.38,28.65 28.38,31.02 28.25,31.15 23.88,31.15 23.5,31.52 U2.GPIO4
SDA-5V
  Bottom 0.152: 41.25,22.77 41.25,25.27 37.5,25.27 37.12,25.65 R10.1 | 41.25,22.77 41.25,20.65 39,18.4 Q1.3 | 41.25,22.77 36.12,22.77 36.12,20.9 35.88,20.65 33.38,20.65 33,20.27 31.38,20.27 31.38,17.9 29.88,16.4 29.5,16.4 29.38,16.27 U1.9 29.25,16.27 28.75,16.27 24.88,20.15 1.62,20.15 1.62,42.27 2.88,43.52 3.38,43.52 U3.9
TX  (via drill 0.35)
  Top 0.152: v30.75,27.02 40.62,36.9 40.62,38.27 41.75,39.4 43.12,39.4 43.12,36.9 42.12,35.9 PRG.3
  Bottom 0.152: v30.75,27.02 30.5,27.27 26.5,27.27 25.88,26.65 24.5,26.65 23.5,25.65 U2.TXD0
VCC  (via drill 0.35)
  Top 0.152: 42,23.52 42,30.65 PRG.1 42.12,30.77 43.12,31.77 43.12,34.4 v43,34.52 | 42,23.52 v42,19.77 | v9.5,38.9 10.12,38.27 10.12,37.02 7,33.9 v2.38,33.9 | v39.88,23.52 42,23.52
  Bottom 0.152: 42,41.27 42.12,41.4 C1.1 42,41.27 | 42,41.27 39.38,41.27 LDO2.2 39.25,41.27 33.25,41.27 LDO2.TAB | R7.2 29.38,34.27 29.38,30.15 R8.2 29.38,30.02 34.88,30.02 35.12,29.77 R4.2 35.25,29.77 36.12,30.65 42,30.65 PRG.1 | 39.25,17.02 36.25,17.02 35.62,16.4 Q2.1 | 39.25,17.02 39.88,16.4 Q1.1 | v42,19.77 39.25,17.02 | 42,41.27 42,39.4 42.5,39.4 43.12,38.77 43.12,34.52 v43,34.52 | 2,33.9 2,21.15 5.12,21.15 R3.2 5.25,21.15 7.25,23.15 33.75,23.15 | 2,33.9 2,36.02 3.12,37.15 R2.2 | 33.75,23.15 35.12,21.77 R5.2 | v9.5,38.9 7.62,38.9 7,39.52 U2.VCC | 2,33.9 v2.38,33.9 | v39.88,23.52 39.5,23.15 33.75,23.15

### Text on the board
tNames: 4/IN 4/OUT | 5/IN 5/OUT | 6/IN 6/OUT | 7/IN 7/OUT | 0/IN 0/OUT | 1/IN 1/OUT | 2/IN 2/OUT | 3/IN 3/OUT